# EAGLE schematic imu_v2 (EAGLE 6.4)
REV: 2.0

## Sheet 1 of 4
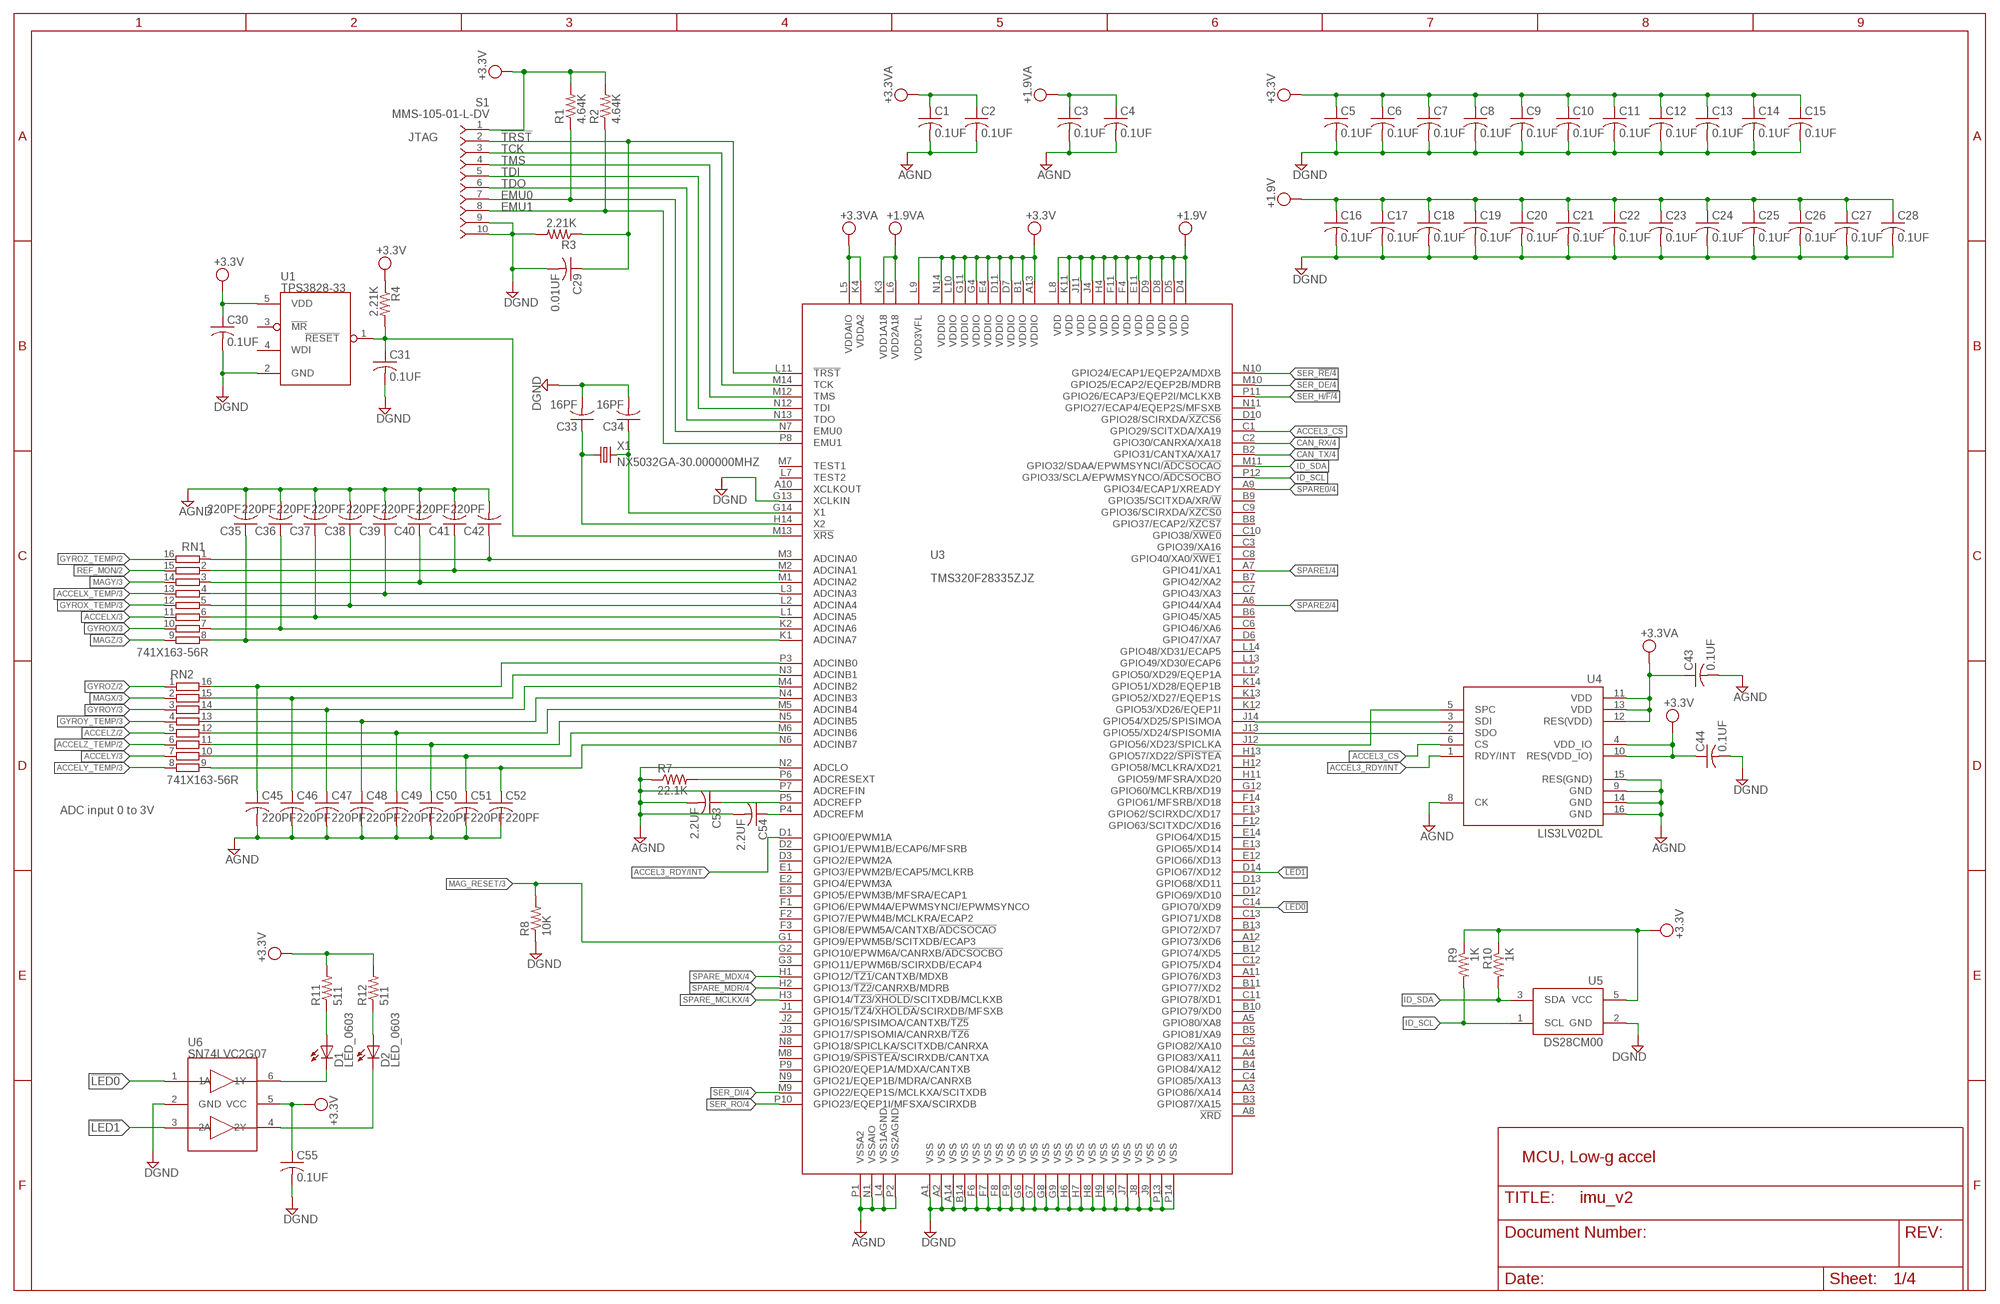
[diagram p0: schematic, sheet 1]

### Parts
C1  0.1UF  C-USC0603K  [C0603K]
C2  0.1UF  C-USC0603K  [C0603K]
C3  0.1UF  C-USC0603K  [C0603K]
C4  0.1UF  C-USC0603K  [C0603K]
C5  0.1UF  C-USC0603K  [C0603K]
C6  0.1UF  C-USC0603K  [C0603K]
C7  0.1UF  C-USC0603K  [C0603K]
C8  0.1UF  C-USC0603K  [C0603K]
C9  0.1UF  C-USC0603K  [C0603K]
C10  0.1UF  C-USC0603K  [C0603K]
C11  0.1UF  C-USC0603K  [C0603K]
C12  0.1UF  C-USC0603K  [C0603K]
C13  0.1UF  C-USC0603K  [C0603K]
C14  0.1UF  C-USC0603K  [C0603K]
C15  0.1UF  C-USC0603K  [C0603K]
C16  0.1UF  C-USC0603K  [C0603K]
C17  0.1UF  C-USC0603K  [C0603K]
C18  0.1UF  C-USC0603K  [C0603K]
C19  0.1UF  C-USC0603K  [C0603K]
C20  0.1UF  C-USC0603K  [C0603K]
C21  0.1UF  C-USC0603K  [C0603K]
C22  0.1UF  C-USC0603K  [C0603K]
C23  0.1UF  C-USC0603K  [C0603K]
C24  0.1UF  C-USC0603K  [C0603K]
C25  0.1UF  C-USC0603K  [C0603K]
C26  0.1UF  C-USC0603K  [C0603K]
C27  0.1UF  C-USC0603K  [C0603K]
C28  0.1UF  C-USC0603K  [C0603K]
C29  0.01UF  C-USC0603K  [C0603K]
C30  0.1UF  C-USC0603K  [C0603K]
C31  0.1UF  C-USC0603K  [C0603K]
C33  16PF  C-USC0603K  [C0603K]
C34  16PF  C-USC0603K  [C0603K]
C35  220PF  C-USC0603K  [C0603K]
C36  220PF  C-USC0603K  [C0603K]
C37  220PF  C-USC0603K  [C0603K]
C38  220PF  C-USC0603K  [C0603K]
C39  220PF  C-USC0603K  [C0603K]
C40  220PF  C-USC0603K  [C0603K]
C41  220PF  C-USC0603K  [C0603K]
C42  220PF  C-USC0603K  [C0603K]
C43  0.1UF  C-USC0603K  [C0603K]
C44  0.1UF  C-USC0603K  [C0603K]
C45  220PF  C-USC0603K  [C0603K]
C46  220PF  C-USC0603K  [C0603K]
C47  220PF  C-USC0603K  [C0603K]
C48  220PF  C-USC0603K  [C0603K]
C49  220PF  C-USC0603K  [C0603K]
C50  220PF  C-USC0603K  [C0603K]
C51  220PF  C-USC0603K  [C0603K]
C52  220PF  C-USC0603K  [C0603K]
C53  2.2UF  C-USC0603K  [C0603K]
C54  2.2UF  C-USC0603K  [C0603K]
C55  0.1UF  C-USC0603K  [C0603K]
D1  LED_0603  [LED_0603]
D2  LED_0603  [LED_0603]
R1  4.64K  R-US_R0603  [R0603]
R2  4.64K  R-US_R0603  [R0603]
R3  2.21K  R-US_R0603  [R0603]
R4  2.21K  R-US_R0603  [R0603]
R7  22.1K  R-US_R0603  [R0603]
R8  10K  R-US_R0603  [R0603]
R9  1K  R-US_R0603  [R0603]
R10  1K  R-US_R0603  [R0603]
R11  511  R-US_R0603  [R0603]
R12  511  R-US_R0603  [R0603]
RN1  741X163-56R  [741X163]
RN2  741X163-56R  [741X163]
S1  MMS-105-01-L-DV  [HEADER_2X5_2MM_TH]
U1  TPS3828-33  [SOT23-5]
U3  TMS320F28335ZJZ  [ZJZ_PBGA176]
U4  LIS3LV02DL  [LIS3LV02DL_LGA16]
U5  DS28CM00  [SOT23-5L]
U6  SN74LVC2G07  [SOT23-6]
X1  NX5032GA-30.000000MHZ  [NX5032GA]

### Nets
!LED0: U3.C14(GPIO70/XD9) U6.1(1A)
!LED1: U3.D14(GPIO67/XD12) U6.3(2A)
!TRST: C29.1 R3.1 S1.2 U3.L11(!TRST!)
+1.9V: C16.1 C17.1 C18.1 C19.1 C20.1 C21.1 C22.1 C23.1 C24.1 C25.1 C26.1 C27.1 C28.1 U3.D4(VDD) U3.D5(VDD) U3.D8(VDD) U3.D9(VDD) U3.E11(VDD) U3.F4(VDD) U3.F11(VDD) U3.H4(VDD) U3.J4(VDD) U3.J11(VDD) U3.K11(VDD) U3.L8(VDD) ; also sheet 4
+1.9VA: C3.1 C4.1 U3.K3(VDD1A18) U3.L6(VDD2A18) ; also sheet 4
+3.3V: C5.1 C6.1 C7.1 C8.1 C9.1 C10.1 C11.1 C12.1 C13.1 C14.1 C15.1 C30.1 C44.1 C55.1 R1.2 R2.2 R4.1 R9.1 R10.1 R11.2 R12.2 S1.1 U1.5(VDD) U3.A13(VDDIO) U3.B1(VDDIO) U3.D7(VDDIO) U3.D11(VDDIO) U3.E4(VDDIO) U3.G4(VDDIO) U3.G11(VDDIO) U3.L9(VDD3VFL) U3.L10(VDDIO) U3.N14(VDDIO) U4.4(VDD_IO) U4.10(RES(VDD_IO)) U5.5(VCC) U6.5(VCC) ; also sheet 4
+3.3VA: C1.1 C2.1 C43.1 U3.K4(VDDA2) U3.L5(VDDAIO) U4.11(VDD) U4.12(RES(VDD)) U4.13(VDD) ; also sheet 3,4
ACCEL3_CLK: U3.J12(GPIO56/XD23/SPICLKA) U4.5(SPC)
ACCEL3_CS: U3.C1(GPIO29/SCITXDA/XA19) U4.6(CS)
ACCEL3_RDY/INT: U3.D1(GPIO0/EPWM1A) U4.1(RDY/INT)
ACCEL3_SIMO: U3.J14(GPIO54/XD25/SPISIMOA) U4.3(SDI)
ACCEL3_SOMI: U3.J13(GPIO55/XD24/SPISOMIA) U4.2(SDO)
ACCELX: RN1.11 ; also sheet 3
ACCELX_TEMP: RN1.13 ; also sheet 3
ACCELY: RN2.7 ; also sheet 3
ACCELY_TEMP: RN2.8 ; also sheet 3
ACCELZ: RN2.5 ; also sheet 2
ACCELZ_TEMP: RN2.6 ; also sheet 2
AGND: C1.2 C2.2 C3.2 C4.2 C35.2 C36.2 C37.2 C38.2 C39.2 C40.2 C41.2 C42.2 C43.2 C45.2 C46.2 C47.2 C48.2 C49.2 C50.2 C51.2 C52.2 C53.2 C54.2 R7.1 U3.L4(VSS1AGND) U3.N1(VSSAIO) U3.N2(ADCLO) U3.P1(VSSA2) U3.P2(VSS2AGND) U3.P7(ADCREFIN) U4.8(CK) U4.9(GND) U4.14(GND) U4.15(RES(GND)) U4.16(GND) ; also sheet 2,3,4
CAN_RX: U3.C2(GPIO30/CANRXA/XA18) ; also sheet 4
CAN_TX: U3.B2(GPIO31/CANTXA/XA17) ; also sheet 4
DGND: C5.2 C6.2 C7.2 C8.2 C9.2 C10.2 C11.2 C12.2 C13.2 C14.2 C15.2 C16.2 C17.2 C18.2 C19.2 C20.2 C21.2 C22.2 C23.2 C24.2 C25.2 C26.2 C27.2 C28.2 C29.2 C30.2 C31.2 C33.2 C34.2 C44.2 C55.2 R3.2 R8.1 S1.9 S1.10 U1.2(GND) U3.A1(VSS) U3.A2(VSS) U3.A14(VSS) U3.B14(VSS) U3.F6(VSS) U3.F7(VSS) U3.F8(VSS) U3.F9(VSS) U3.G6(VSS) U3.G7(VSS) U3.G8(VSS) U3.G9(VSS) U3.G13(XCLKIN) U3.H6(VSS) U3.H7(VSS) U3.H8(VSS) U3.H9(VSS) U3.J6(VSS) U3.J7(VSS) U3.J8(VSS) U3.J9(VSS) U3.P13(VSS) U3.P14(VSS) U5.2(GND) U6.2(GND) ; also sheet 4
EMU0: R1.1 S1.7 U3.N7(EMU0)
EMU1: R2.1 S1.8 U3.P8(EMU1)
GYROX: RN1.10 ; also sheet 3
GYROX_TEMP: RN1.12 ; also sheet 3
GYROY: RN2.3 ; also sheet 3
GYROY_TEMP: RN2.4 ; also sheet 3
GYROZ: RN2.1 ; also sheet 2
GYROZ_TEMP: RN1.16 ; also sheet 2
ID_SCL: R9.2 U3.P12(GPIO33/SCLA/EPWMSYNCO/!ADCSOCBO!) U5.1(SCL)
ID_SDA: R10.2 U3.M11(GPIO32/SDAA/EPWMSYNCI/!ADCSOCAO!) U5.3(SDA)
MAG_RESET: R8.2 U3.G1(GPIO9/EPWM5B/SCITXDB/ECAP3) ; also sheet 3
MAGX: RN2.2 ; also sheet 3
MAGY: RN1.14 ; also sheet 3
MAGZ: RN1.9 ; also sheet 3
N$14: C42.1 RN1.1 U3.M3(ADCINA0)
N$15: C41.1 RN1.2 U3.M2(ADCINA1)
N$16: C40.1 RN1.3 U3.M1(ADCINA2)
N$17: C39.1 RN1.4 U3.L3(ADCINA3)
N$18: C38.1 RN1.5 U3.L2(ADCINA4)
N$19: C37.1 RN1.6 U3.L1(ADCINA5)
N$20: C36.1 RN1.7 U3.K2(ADCINA6)
N$21: C35.1 RN1.8 U3.K1(ADCINA7)
N$22: C45.1 RN2.16 U3.P3(ADCINB0)
N$23: C46.1 RN2.15 U3.N3(ADCINB1)
N$24: C47.1 RN2.14 U3.M4(ADCINB2)
N$25: C48.1 RN2.13 U3.N4(ADCINB3)
N$26: C49.1 RN2.12 U3.M5(ADCINB4)
N$27: C50.1 RN2.11 U3.N5(ADCINB5)
N$28: C51.1 RN2.10 U3.M6(ADCINB6)
N$29: C52.1 RN2.9 U3.N6(ADCINB7)
N$34: C31.1 R4.2 U1.1(!RESET) U3.M13(!XRS!)
N$35: C33.1 U3.H14(X2) X1.1
N$37: C34.1 U3.G14(X1) X1.2
N$45: R7.2 U3.P6(ADCRESEXT)
N$46: C54.1 U3.P4(ADCREFM)
N$47: C53.1 U3.P5(ADCREFP)
N$112: D1.A R11.1
N$116: D2.A R12.1
N$118: D1.C U6.6(1Y)
N$119: D2.C U6.4(2Y)
REF_MON: RN1.15 ; also sheet 2
SER_!RE: U3.N10(GPIO24/ECAP1/EQEP2A/MDXB) ; also sheet 4
SER_DE: U3.M10(GPIO25/ECAP2/EQEP2B/MDRB) ; also sheet 4
SER_DI: U3.M9(GPIO22/EQEP1S/MCLKXA/SCITXDB) ; also sheet 4
SER_H/!F: U3.P11(GPIO26/ECAP3/EQEP2I/MCLKXB) ; also sheet 4
SER_RO: U3.P10(GPIO23/EQEP1I/MFSXA/SCIRXDB) ; also sheet 4
SPARE0: U3.A9(GPIO34/ECAP1/XREADY) ; also sheet 4
SPARE1: U3.A7(GPIO41/XA1) ; also sheet 4
SPARE2: U3.A6(GPIO44/XA4) ; also sheet 4
SPARE_MCLKX: U3.H3(GPIO14/!TZ3!/!XHOLD!/SCITXDB/MCLKXB) ; also sheet 4
SPARE_MDR: U3.H2(GPIO13/!TZ2!/CANRXB/MDRB) ; also sheet 4
SPARE_MDX: U3.H1(GPIO12/!TZ1!/CANTXB/MDXB) ; also sheet 4
TCK: S1.3 U3.M14(TCK)
TDI: S1.5 U3.N12(TDI)
TDO: S1.6 U3.N13(TDO)
TMS: S1.4 U3.M12(TMS)
Unconnected: U1.3(!MR) U1.4(WDI) U3.A3(GPIO86/XA14) U3.A4(GPIO83/XA11) U3.A5(GPIO80/XA8) U3.A8(!XRD!) U3.A10(XCLKOUT) U3.A11(GPIO76/XD3) U3.A12(GPIO73/XD6) U3.B3(GPIO87/XA15) U3.B4(GPIO84/XA12) U3.B5(GPIO81/XA9) U3.B6(GPIO45/XA5) U3.B7(GPIO42/XA2) U3.B8(GPIO37/ECAP2/!XZCS7!) U3.B9(GPIO35/SCITXDA/XR/!W!) U3.B10(GPIO79/XD0) U3.B11(GPIO77/XD2) U3.B12(GPIO74/XD5) U3.B13(GPIO72/XD7) U3.C3(GPIO39/XA16) U3.C4(GPIO85/XA13) U3.C5(GPIO82/XA10) U3.C6(GPIO46/XA6) U3.C7(GPIO43/XA3) U3.C8(GPIO40/XA0/!XWE1!) U3.C9(GPIO36/SCIRXDA/!XZCS0!) U3.C10(GPIO38/!XWE0!) U3.C11(GPIO78/XD1) U3.C12(GPIO75/XD4) U3.C13(GPIO71/XD8) U3.D2(GPIO1/EPWM1B/ECAP6/MFSRB) U3.D3(GPIO2/EPWM2A) U3.D6(GPIO47/XA7) U3.D10(GPIO28/SCIRXDA/!XZCS6!) U3.D12(GPIO69/XD10) U3.D13(GPIO68/XD11) U3.E1(GPIO3/EPWM2B/ECAP5/MCLKRB) U3.E2(GPIO4/EPWM3A) U3.E3(GPIO5/EPWM3B/MFSRA/ECAP1) U3.E12(GPIO66/XD13) U3.E13(GPIO65/XD14) U3.E14(GPIO64/XD15) U3.F1(GPIO6/EPWM4A/EPWMSYNCI/EPWMSYNCO) U3.F2(GPIO7/EPWM4B/MCLKRA/ECAP2) U3.F3(GPIO8/EPWM5A/CANTXB/!ADCSOCAO!) U3.F12(GPIO63/SCITXDC/XD16) U3.F13(GPIO62/SCIRXDC/XD17) U3.F14(GPIO61/MFSRB/XD18) U3.G2(GPIO10/EPWM6A/CANRXB/!ADCSOCBO!) U3.G3(GPIO11/EPWM6B/SCIRXDB/ECAP4) U3.G12(GPIO60/MCLKRB/XD19) U3.H11(GPIO59/MFSRA/XD20) U3.H12(GPIO58/MCLKRA/XD21) U3.H13(GPIO57/XD22/!SPISTEA!) U3.J1(GPIO15/!TZ4!/!XHOLDA!/SCIRXDB/MFSXB) U3.J2(GPIO16/SPISIMOA/CANTXB/!TZ5!) U3.J3(GPIO17/SPISOMIA/CANRXB/!TZ6!) U3.K12(GPIO53/XD26/EQEP1I) U3.K13(GPIO52/XD27/EQEP1S) U3.K14(GPIO51/XD28/EQEP1B) U3.L7(TEST2) U3.L12(GPIO50/XD29/EQEP1A) U3.L13(GPIO49/XD30/ECAP6) U3.L14(GPIO48/XD31/ECAP5) U3.M7(TEST1) U3.M8(GPIO19/!SPISTEA!/SCIRXDB/CANTXA) U3.N8(GPIO18/SPICLKA/SCITXDB/CANRXA) U3.N9(GPIO21/EQEP1B/MDRA/CANRXB) U3.N11(GPIO27/ECAP4/EQEP2S/MFSXB) U3.P9(GPIO20/EQEP1A/MDXA/CANTXB)

### Notes on the sheet
- JTAG
- ADC input 0 to 3V
- MCU, Low-g accel

## Sheet 2 of 4
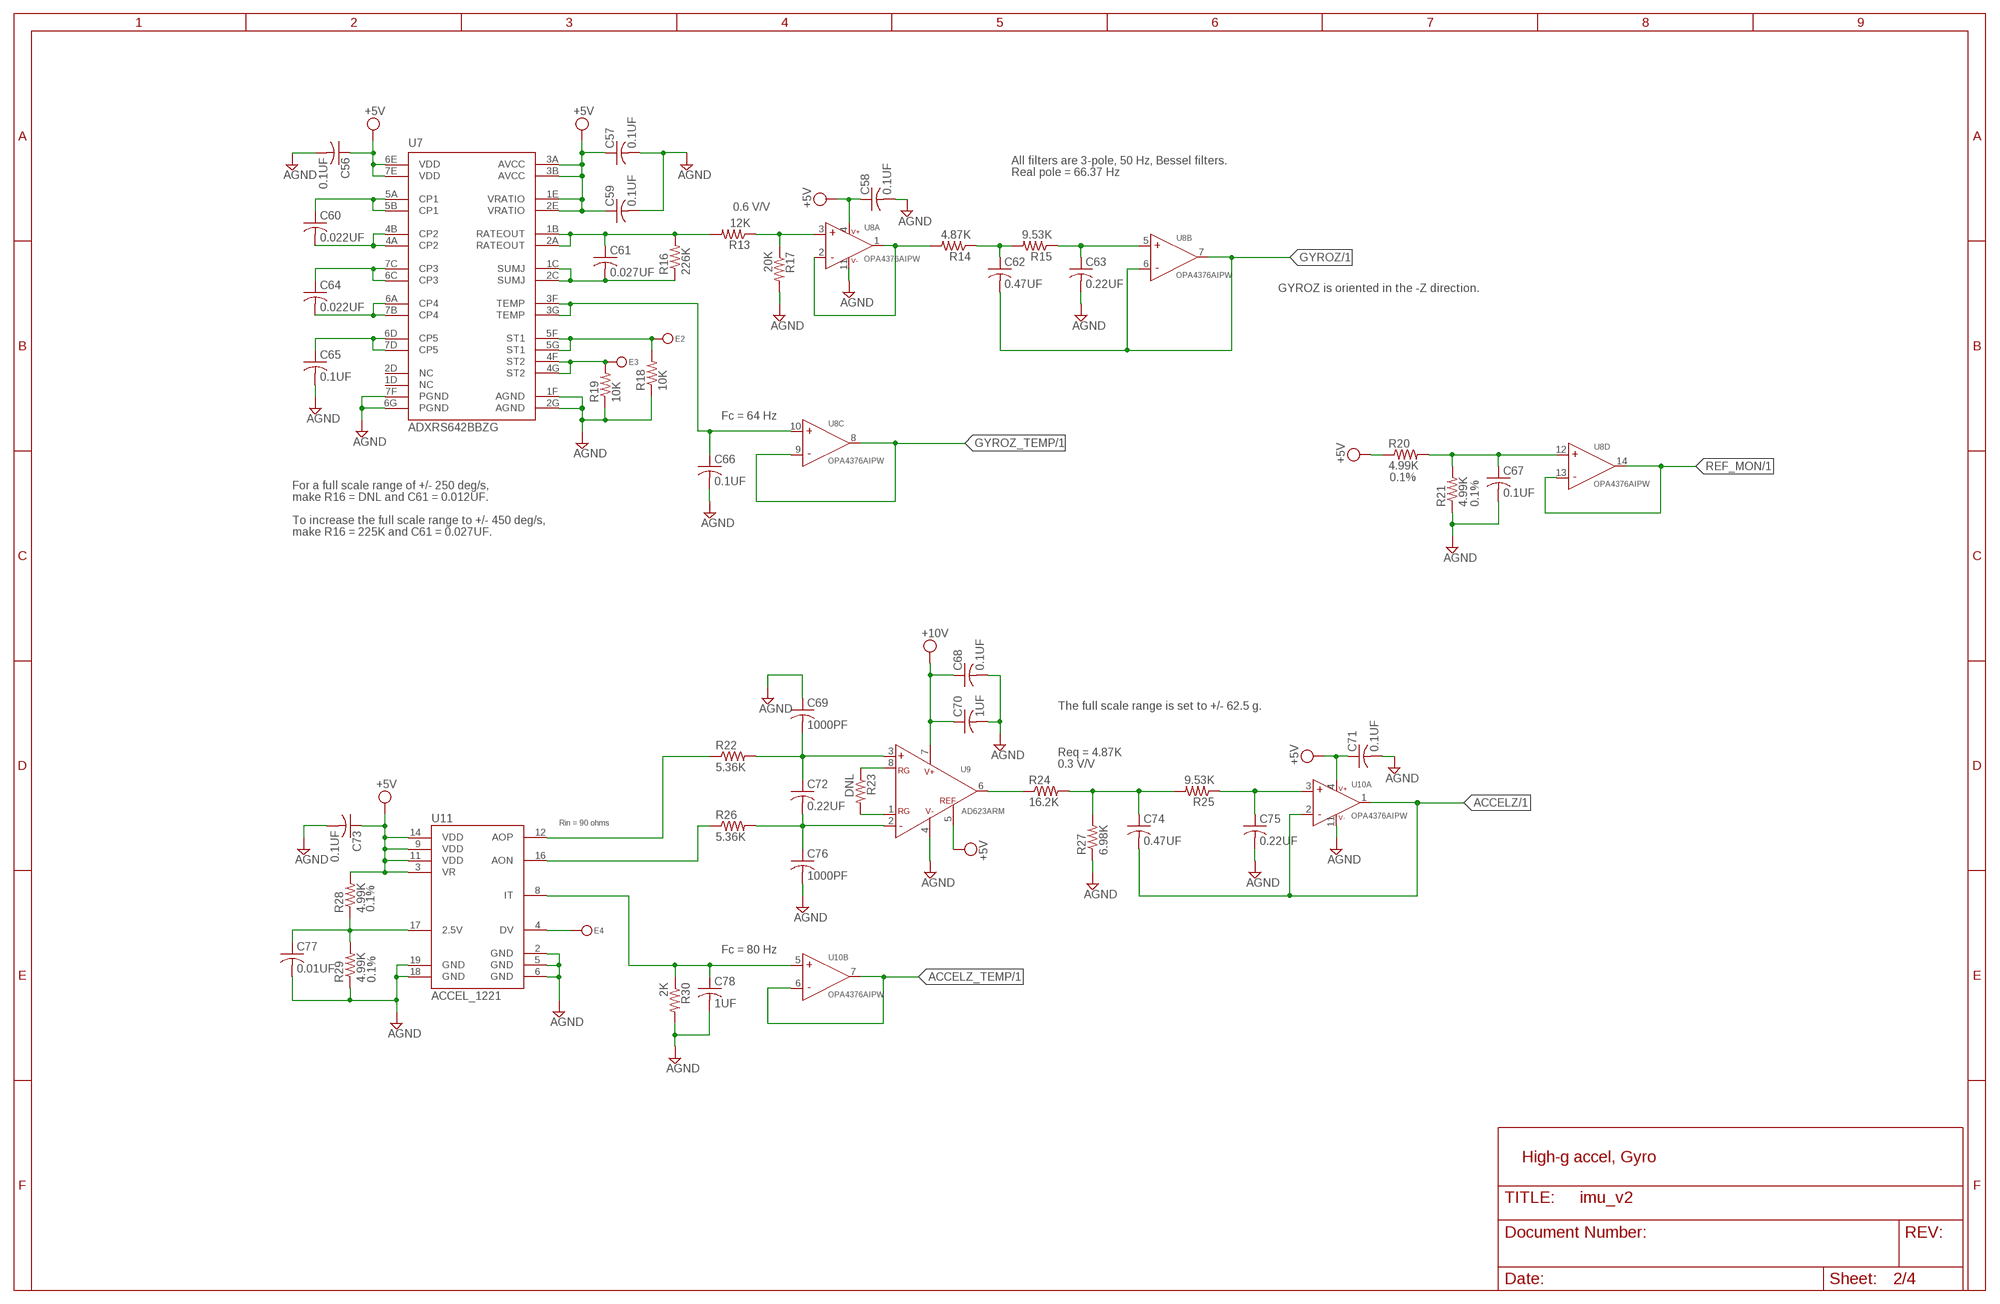
[diagram p1: schematic, sheet 2]

### Parts
C56  0.1UF  C-USC0603K  [C0603K]
C57  0.1UF  C-USC0603K  [C0603K]
C58  0.1UF  C-USC0603K  [C0603K]
C59  0.1UF  C-USC0603K  [C0603K]
C60  0.022UF  C-USC0603K  [C0603K]
C61  0.027UF  C-USC0603K  [C0603K]
C62  0.47UF  C-USC0603K  [C0603K]
C63  0.22UF  C-USC0603K  [C0603K]
C64  0.022UF  C-USC0603K  [C0603K]
C65  0.1UF  C-USC0603K  [C0603K]
C66  0.1UF  C-USC0603K  [C0603K]
C67  0.1UF  C-USC0603K  [C0603K]
C68  0.1UF  C-USC0603K  [C0603K]
C69  1000PF  C-USC0603K  [C0603K]
C70  1UF  C-USC0603K  [C0603K]
C71  0.1UF  C-USC0603K  [C0603K]
C72  0.22UF  C-USC0603K  [C0603K]
C73  0.1UF  C-USC0603K  [C0603K]
C74  0.47UF  C-USC0603K  [C0603K]
C75  0.22UF  C-USC0603K  [C0603K]
C76  1000PF  C-USC0603K  [C0603K]
C77  0.01UF  C-USC0603K  [C0603K]
C78  1UF  C-USC0603K  [C0603K]
E2  TP30  [TP30]
E3  TP30  [TP30]
E4  TP30  [TP30]
R13  12K  R-US_R0603  [R0603]
R14  4.87K  R-US_R0603  [R0603]
R15  9.53K  R-US_R0603  [R0603]
R16  226K  R-US_R0603  [R0603]
R17  20K  R-US_R0603  [R0603]
R18  10K  R-US_R0603  [R0603]
R19  10K  R-US_R0603  [R0603]
R20  4.99K  R-US_R0603  [R0603]
R21  4.99K  R-US_R0603  [R0603]
R22  5.36K  R-US_R0603  [R0603]
R23  DNL  R-US_R0603  [R0603]
R24  16.2K  R-US_R0603  [R0603]
R25  9.53K  R-US_R0603  [R0603]
R26  5.36K  R-US_R0603  [R0603]
R27  6.98K  R-US_R0603  [R0603]
R28  4.99K  R-US_R0603  [R0603]
R29  4.99K  R-US_R0603  [R0603]
R30  2K  R-US_R0603  [R0603]
U7  ADXRS642BBZG  [ADXRS_CBGA32]
U8  OPA4376AIPW  [TSSOP14]
U9  AD623ARM  [MSOP8]
U10  OPA4376AIPW  [TSSOP14]
U11  ACCEL_1221  [1221_LCC]

### Nets
+5V: C56.1 C57.1 C58.1 C59.1 C71.1 C73.1 R20.1 R28.2 U7.1E(VRATIO) U7.2E(VRATIO) U7.3A(AVCC) U7.3B(AVCC) U7.6E(VDD) U7.7E(VDD) U8.4(A:V+) U9.5(REF) U10.4(A:V+) U11.3(VR) U11.9(VDD) U11.11(VDD) U11.14(VDD) ; also sheet 3,4
+10V: C68.1 C70.1 U9.7(VS+) ; also sheet 3,4
ACCELZ: C74.2 U10.1(A:OUT) U10.2(A:IN-) ; also sheet 1
ACCELZ_TEMP: U10.6(B:IN-) U10.7(B:OUT) ; also sheet 1
AGND: C56.2 C57.2 C58.2 C59.2 C63.2 C65.2 C66.2 C67.2 C68.2 C69.1 C70.2 C71.2 C73.2 C75.2 C76.2 C77.2 C78.2 R17.2 R18.1 R19.1 R21.1 R27.1 R29.1 R30.2 U7.1F(AGND) U7.2G(AGND) U7.6G(PGND) U7.7F(PGND) U8.11(A:V-) U9.4(VS-) U10.11(A:V-) U11.2(GND) U11.5(GND) U11.6(GND) U11.18(GND) U11.19(GND) ; also sheet 1,3,4
GYROZ: C62.2 U8.6(B:IN-) U8.7(B:OUT) ; also sheet 1
GYROZ_TEMP: U8.8(C:OUT) U8.9(C:IN-) ; also sheet 1
N$1: C60.1 U7.5A(CP1) U7.5B(CP1)
N$2: C60.2 U7.4A(CP2) U7.4B(CP2)
N$3: C64.1 U7.6C(CP3) U7.7C(CP3)
N$4: C64.2 U7.6A(CP4) U7.7B(CP4)
N$5: C65.1 U7.6D(CP5) U7.7D(CP5)
N$6: C77.1 R28.1 R29.2 U11.17(2.5V)
N$7: C61.2 R16.1 U7.1C(SUMJ) U7.2C(SUMJ)
N$8: E4.1 U11.4(DV)
N$9: C61.1 R13.2 R16.2 U7.1B(RATEOUT) U7.2A(RATEOUT)
N$10: C66.1 U7.3F(TEMP) U7.3G(TEMP) U8.10(C:IN+)
N$11: C78.1 R30.1 U10.5(B:IN+) U11.8(IT)
N$12: R22.1 U11.12(AOP)
N$13: R26.1 U11.16(AON)
N$30: R13.1 R17.1 U8.3(A:IN+)
N$31: R14.2 U8.1(A:OUT) U8.2(A:IN-)
N$32: C62.1 R14.1 R15.2
N$33: C63.1 R15.1 U8.5(B:IN+)
N$36: C69.2 C72.1 R22.2 U9.3(IN+)
N$38: C72.2 C76.1 R26.2 U9.2(IN-)
N$39: C67.1 R20.2 R21.2 U8.12(D:IN+)
N$40: R23.1 U9.8(RG)
N$41: R23.2 U9.1(RG)
N$42: R24.1 U9.6(VOUT)
N$43: C74.1 R24.2 R25.2 R27.2
N$44: C75.1 R25.1 U10.3(A:IN+)
N$124: E2.1 R18.2 U7.5F(ST1) U7.5G(ST1)
N$125: E3.1 R19.2 U7.4F(ST2) U7.4G(ST2)
REF_MON: U8.13(D:IN-) U8.14(D:OUT) ; also sheet 1
Unconnected: U7.1D(NC) U7.2D(NC)

### Notes on the sheet
- All filters are 3-pole, 50 Hz, Bessel filters.
- Real pole = 66.37 Hz
- 0.6 V/V
- GYROZ is oriented in the -Z direction.
- Fc = 64 Hz
- For a full scale range of +/- 250 deg/s,
- make R16 = DNL and C61 = 0.012UF.
- To increase the full scale range to +/- 450 deg/s,
- make R16 = 225K and C61 = 0.027UF.
- The full scale range is set to +/- 62.5 g.
- Req = 4.87K
- 0.3 V/V
- Rin = 90 ohms
- Fc = 80 Hz
- High-g accel, Gyro

## Sheet 3 of 4
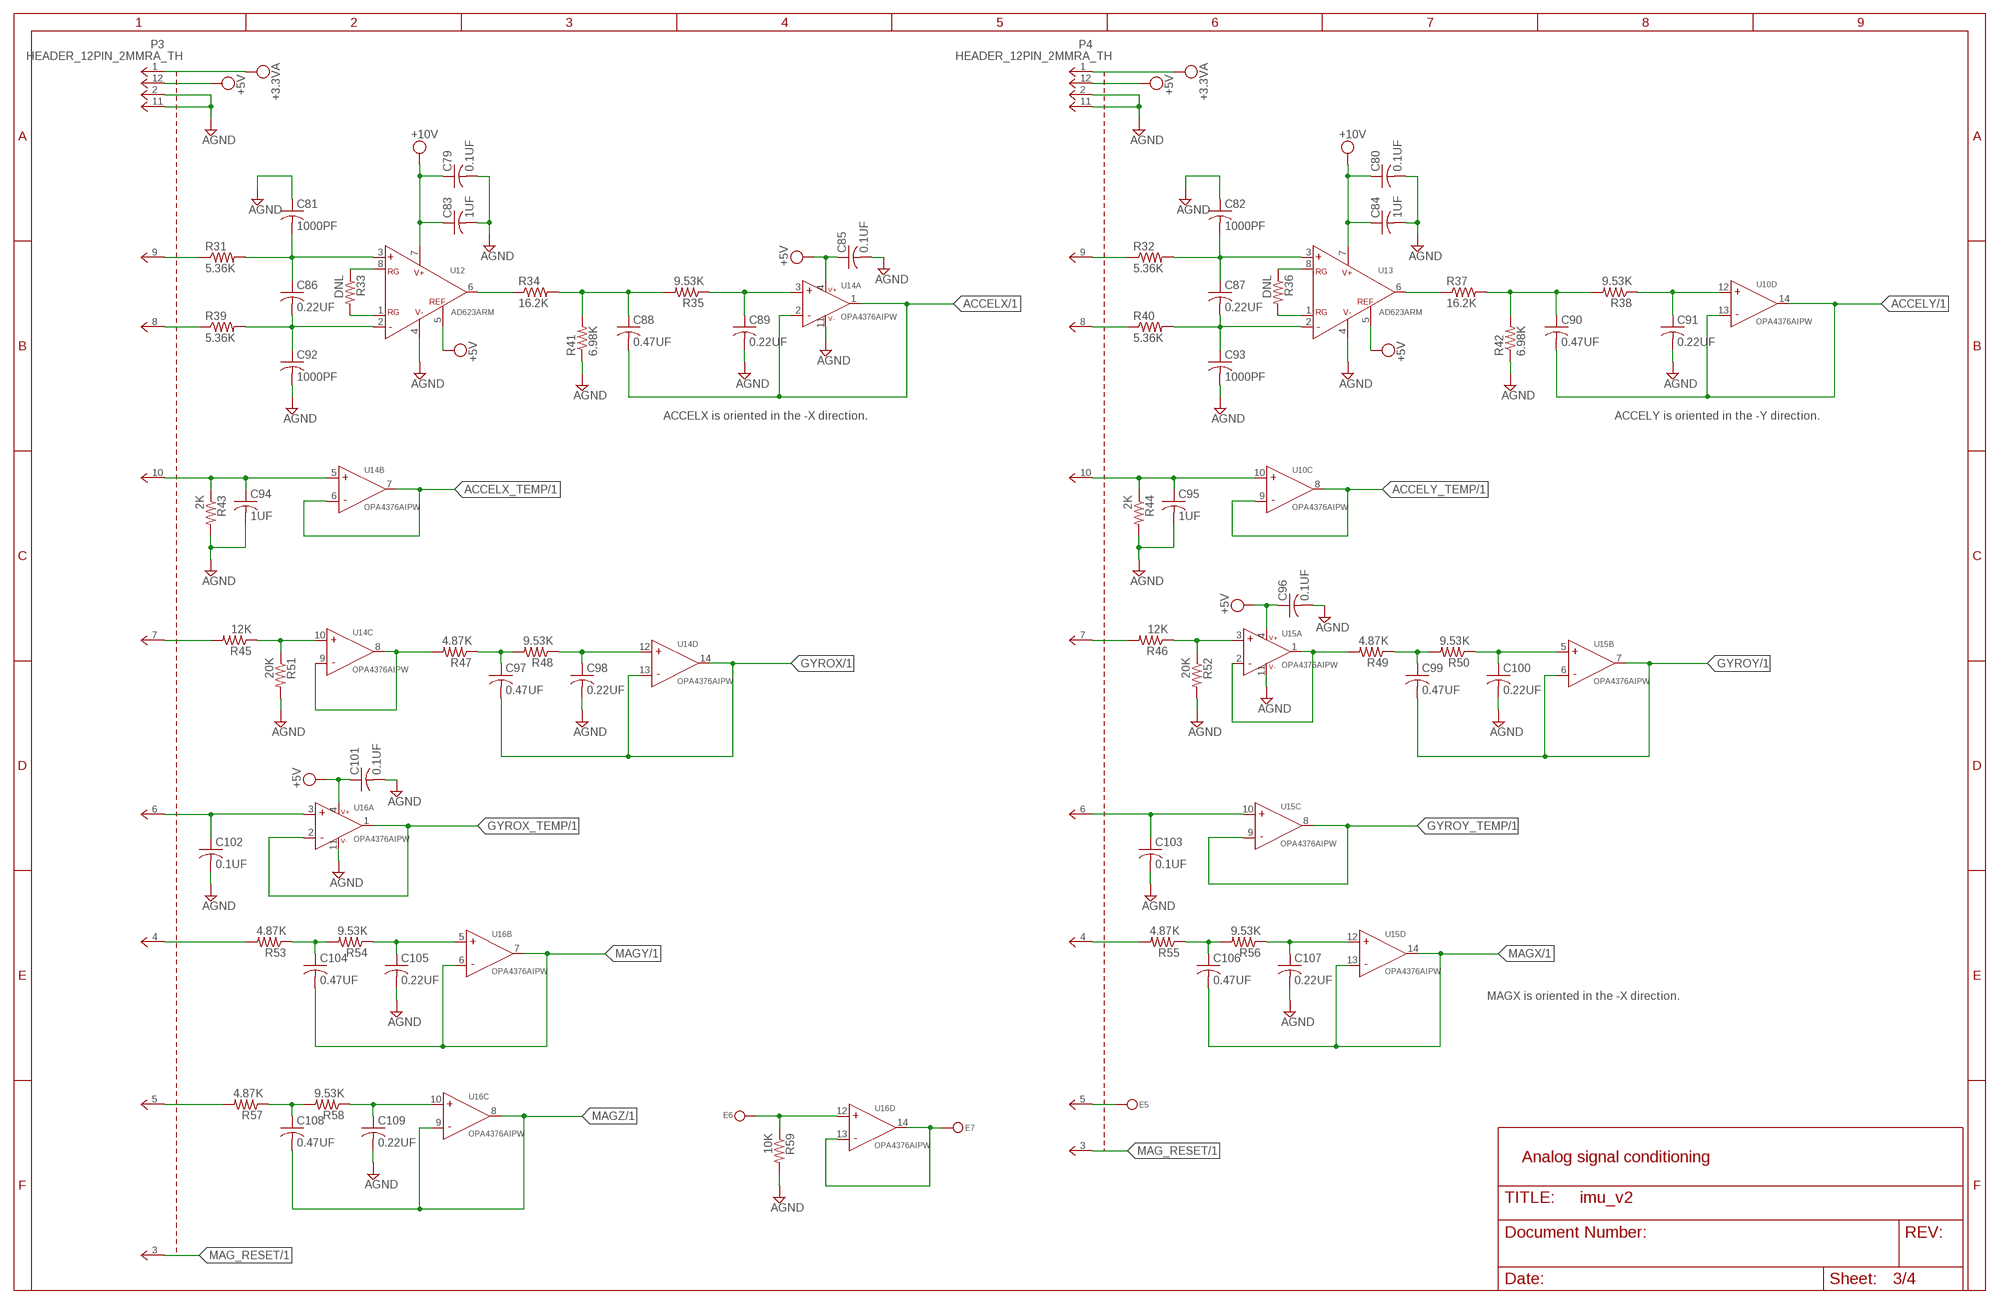
[diagram p2: schematic, sheet 3]

### Parts
C79  0.1UF  C-USC0603K  [C0603K]
C80  0.1UF  C-USC0603K  [C0603K]
C81  1000PF  C-USC0603K  [C0603K]
C82  1000PF  C-USC0603K  [C0603K]
C83  1UF  C-USC0603K  [C0603K]
C84  1UF  C-USC0603K  [C0603K]
C85  0.1UF  C-USC0603K  [C0603K]
C86  0.22UF  C-USC0603K  [C0603K]
C87  0.22UF  C-USC0603K  [C0603K]
C88  0.47UF  C-USC0603K  [C0603K]
C89  0.22UF  C-USC0603K  [C0603K]
C90  0.47UF  C-USC0603K  [C0603K]
C91  0.22UF  C-USC0603K  [C0603K]
C92  1000PF  C-USC0603K  [C0603K]
C93  1000PF  C-USC0603K  [C0603K]
C94  1UF  C-USC0603K  [C0603K]
C95  1UF  C-USC0603K  [C0603K]
C96  0.1UF  C-USC0603K  [C0603K]
C97  0.47UF  C-USC0603K  [C0603K]
C98  0.22UF  C-USC0603K  [C0603K]
C99  0.47UF  C-USC0603K  [C0603K]
C100  0.22UF  C-USC0603K  [C0603K]
C101  0.1UF  C-USC0603K  [C0603K]
C102  0.1UF  C-USC0603K  [C0603K]
C103  0.1UF  C-USC0603K  [C0603K]
C104  0.47UF  C-USC0603K  [C0603K]
C105  0.22UF  C-USC0603K  [C0603K]
C106  0.47UF  C-USC0603K  [C0603K]
C107  0.22UF  C-USC0603K  [C0603K]
C108  0.47UF  C-USC0603K  [C0603K]
C109  0.22UF  C-USC0603K  [C0603K]
E5  TP30  [TP30]
E6  TP30  [TP30]
E7  TP30  [TP30]
P3  HEADER_12PIN_2MMRA_TH  [TMM-112-01-T-S-RA]
P4  HEADER_12PIN_2MMRA_TH  [TMM-112-01-T-S-RA]
R31  5.36K  R-US_R0603  [R0603]
R32  5.36K  R-US_R0603  [R0603]
R33  DNL  R-US_R0603  [R0603]
R34  16.2K  R-US_R0603  [R0603]
R35  9.53K  R-US_R0603  [R0603]
R36  DNL  R-US_R0603  [R0603]
R37  16.2K  R-US_R0603  [R0603]
R38  9.53K  R-US_R0603  [R0603]
R39  5.36K  R-US_R0603  [R0603]
R40  5.36K  R-US_R0603  [R0603]
R41  6.98K  R-US_R0603  [R0603]
R42  6.98K  R-US_R0603  [R0603]
R43  2K  R-US_R0603  [R0603]
R44  2K  R-US_R0603  [R0603]
R45  12K  R-US_R0603  [R0603]
R46  12K  R-US_R0603  [R0603]
R47  4.87K  R-US_R0603  [R0603]
R48  9.53K  R-US_R0603  [R0603]
R49  4.87K  R-US_R0603  [R0603]
R50  9.53K  R-US_R0603  [R0603]
R51  20K  R-US_R0603  [R0603]
R52  20K  R-US_R0603  [R0603]
R53  4.87K  R-US_R0603  [R0603]
R54  9.53K  R-US_R0603  [R0603]
R55  4.87K  R-US_R0603  [R0603]
R56  9.53K  R-US_R0603  [R0603]
R57  4.87K  R-US_R0603  [R0603]
R58  9.53K  R-US_R0603  [R0603]
R59  10K  R-US_R0603  [R0603]
U12  AD623ARM  [MSOP8]
U13  AD623ARM  [MSOP8]
U14  OPA4376AIPW  [TSSOP14]
U15  OPA4376AIPW  [TSSOP14]
U16  OPA4376AIPW  [TSSOP14]

### Nets
+3.3VA: P3.1 P4.1 ; also sheet 1,4
+5V: C85.1 C96.1 C101.1 P3.12 P4.12 U12.5(REF) U13.5(REF) U14.4(A:V+) U15.4(A:V+) U16.4(A:V+) ; also sheet 2,4
+10V: C79.1 C80.1 C83.1 C84.1 U12.7(VS+) U13.7(VS+) ; also sheet 2,4
ACCELX: C88.2 U14.1(A:OUT) U14.2(A:IN-) ; also sheet 1
ACCELX_TEMP: U14.6(B:IN-) U14.7(B:OUT) ; also sheet 1
ACCELY: C90.2 U10.13(D:IN-) U10.14(D:OUT) ; also sheet 1
ACCELY_TEMP: U10.8(C:OUT) U10.9(C:IN-) ; also sheet 1
AGND: C79.2 C80.2 C81.1 C82.1 C83.2 C84.2 C85.2 C89.2 C91.2 C92.2 C93.2 C94.2 C95.2 C96.2 C98.2 C100.2 C101.2 C102.2 C103.2 C105.2 C107.2 C109.2 P3.2 P3.11 P4.2 P4.11 R41.1 R42.1 R43.2 R44.2 R51.2 R52.2 R59.2 U12.4(VS-) U13.4(VS-) U14.11(A:V-) U15.11(A:V-) U16.11(A:V-) ; also sheet 1,2,4
GYROX: C97.2 U14.13(D:IN-) U14.14(D:OUT) ; also sheet 1
GYROX_TEMP: U16.1(A:OUT) U16.2(A:IN-) ; also sheet 1
GYROY: C99.2 U15.6(B:IN-) U15.7(B:OUT) ; also sheet 1
GYROY_TEMP: U15.8(C:OUT) U15.9(C:IN-) ; also sheet 1
MAG_RESET: P3.3 P4.3 ; also sheet 1
MAGX: C106.2 U15.13(D:IN-) U15.14(D:OUT) ; also sheet 1
MAGY: C104.2 U16.6(B:IN-) U16.7(B:OUT) ; also sheet 1
MAGZ: C108.2 U16.8(C:OUT) U16.9(C:IN-) ; also sheet 1
N$48: E7.1 U16.13(D:IN-) U16.14(D:OUT)
N$49: E6.1 R59.1 U16.12(D:IN+)
N$56: E5.1 P4.5
N$68: P3.7 R45.2
N$69: R45.1 R51.1 U14.10(C:IN+)
N$70: R47.2 U14.8(C:OUT) U14.9(C:IN-)
N$72: C97.1 R47.1 R48.2
N$73: C98.1 R48.1 U14.12(D:IN+)
N$74: P4.7 R46.2
N$75: R46.1 R52.1 U15.3(A:IN+)
N$76: R49.2 U15.1(A:OUT) U15.2(A:IN-)
N$77: C99.1 R49.1 R50.2
N$78: C100.1 R50.1 U15.5(B:IN+)
N$79: C103.1 P4.6 U15.10(C:IN+)
N$80: C102.1 P3.6 U16.3(A:IN+)
N$81: C95.1 P4.10 R44.1 U10.10(C:IN+)
N$82: P3.4 R53.2
N$83: P4.9 R32.1
N$84: C82.2 C87.1 R32.2 U13.3(IN+)
N$85: C87.2 C93.1 R40.2 U13.2(IN-)
N$86: R36.1 U13.8(RG)
N$87: R36.2 U13.1(RG)
N$88: R37.1 U13.6(VOUT)
N$89: C90.1 R37.2 R38.2 R42.2
N$90: C91.1 R38.1 U10.12(D:IN+)
N$91: C94.1 P3.10 R43.1 U14.5(B:IN+)
N$92: P3.9 R31.1
N$93: P3.8 R39.1
N$94: C81.2 C86.1 R31.2 U12.3(IN+)
N$95: C86.2 C92.1 R39.2 U12.2(IN-)
N$96: R33.1 U12.8(RG)
N$97: R33.2 U12.1(RG)
N$98: R34.1 U12.6(VOUT)
N$99: C88.1 R34.2 R35.2 R41.2
N$100: C89.1 R35.1 U14.3(A:IN+)
N$101: P4.8 R40.1
N$102: C104.1 R53.1 R54.2
N$103: C105.1 R54.1 U16.5(B:IN+)
N$104: P3.5 R57.2
N$105: C108.1 R57.1 R58.2
N$106: C109.1 R58.1 U16.10(C:IN+)
N$107: P4.4 R55.2
N$108: C106.1 R55.1 R56.2
N$110: C107.1 R56.1 U15.12(D:IN+)

### Notes on the sheet
- ACCELX is oriented in the -X direction. | ACCELY is oriented in the -Y direction.
- MAGX is oriented in the -X direction.
- Analog signal conditioning

## Sheet 4 of 4
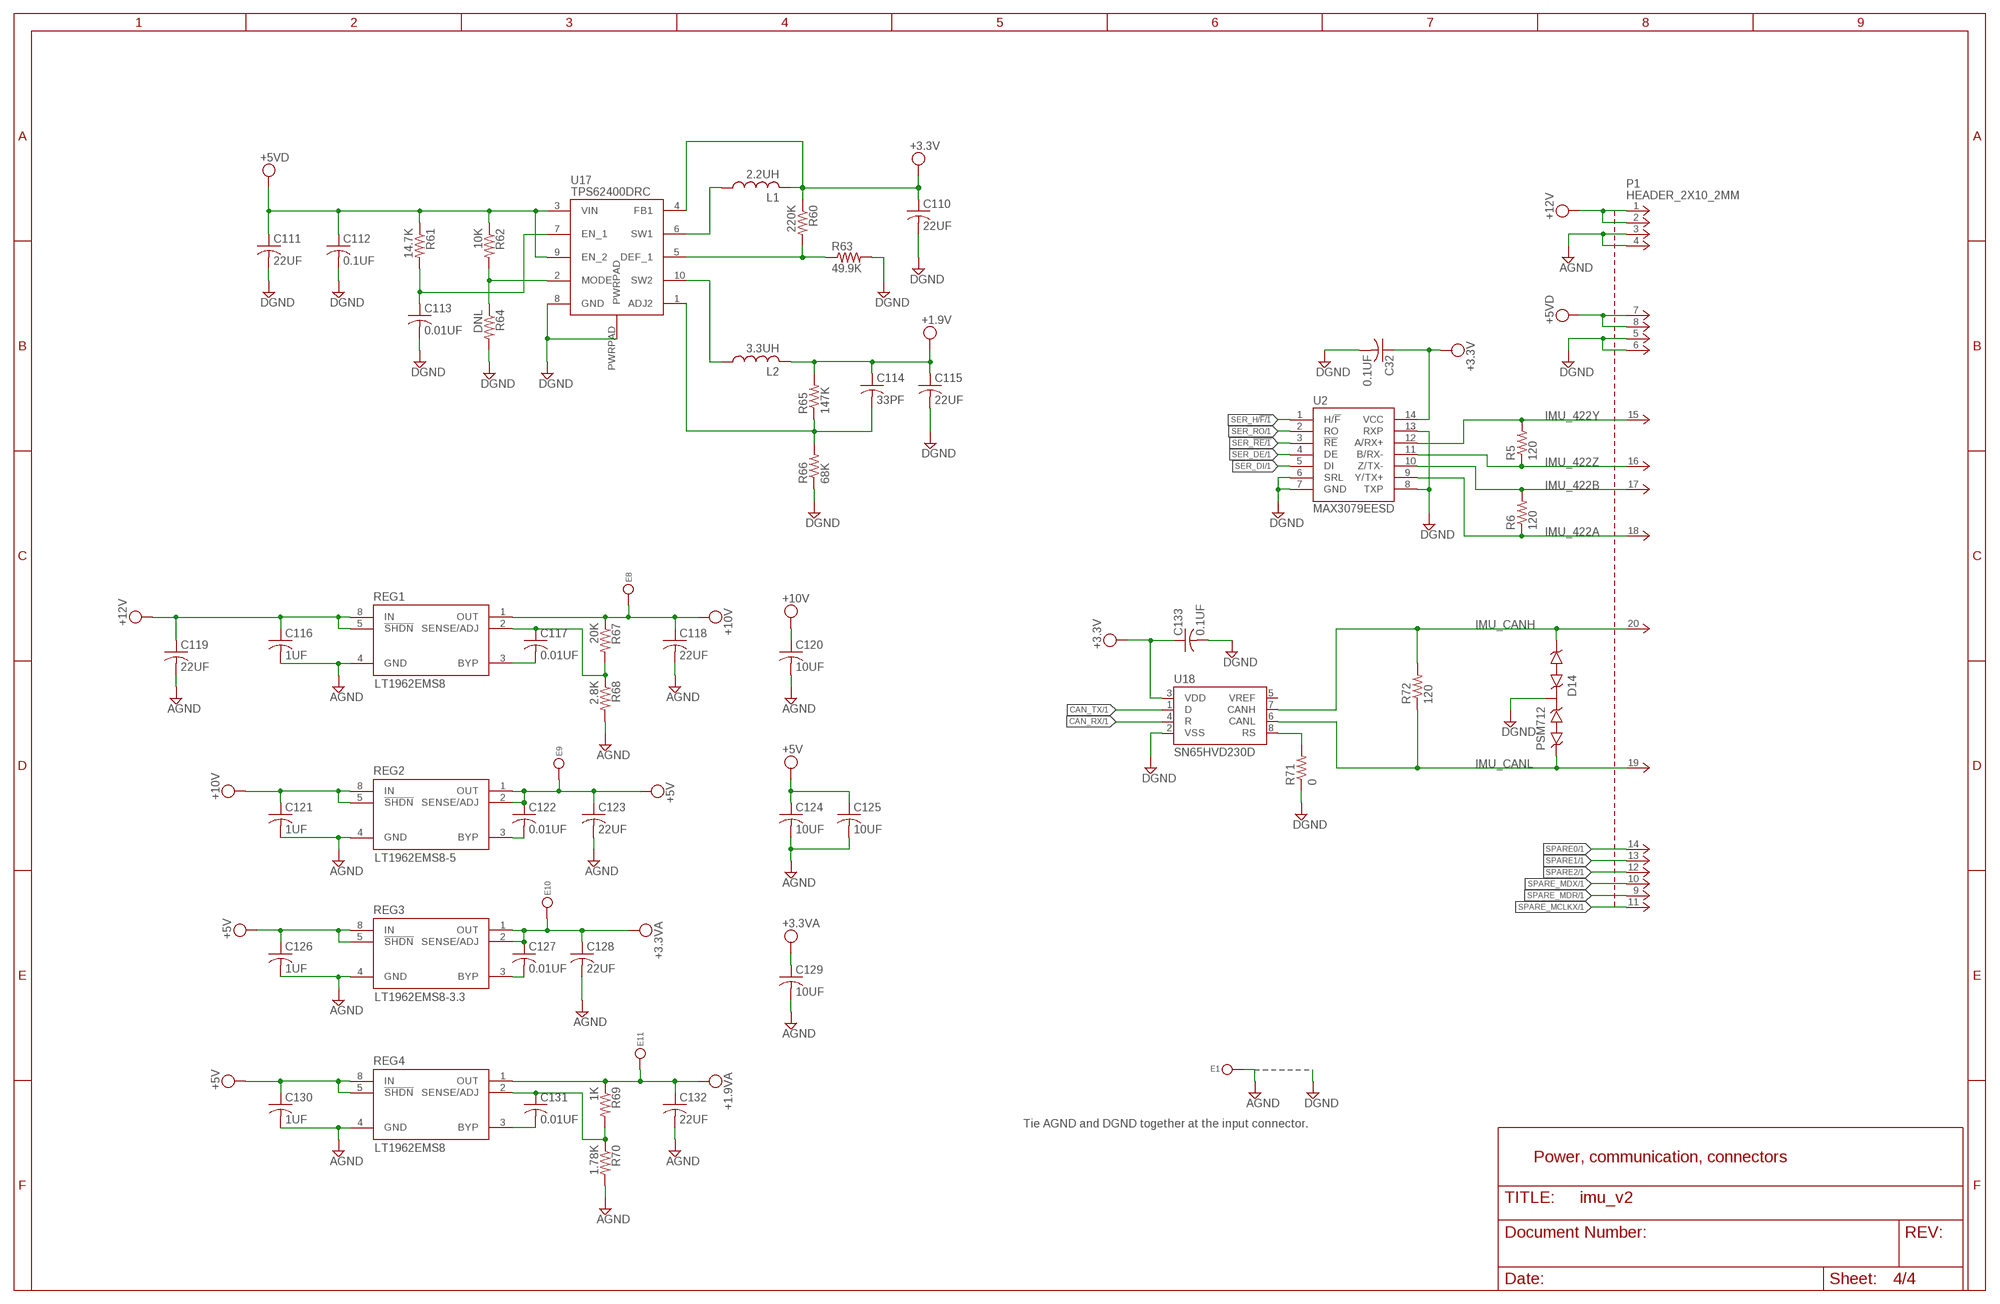
[diagram p3: schematic, sheet 4]

### Parts
C32  0.1UF  C-USC0603K  [C0603K]
C110  22UF  C-USC1210K  [C1210K]
C111  22UF  C-USC1210K  [C1210K]
C112  0.1UF  C-USC0603K  [C0603K]
C113  0.01UF  C-USC0603K  [C0603K]
C114  33PF  C-USC0603K  [C0603K]
C115  22UF  C-USC1210K  [C1210K]
C116  1UF  C-USC0603K  [C0603K]
C117  0.01UF  C-USC0603K  [C0603K]
C118  22UF  C-USC1210K  [C1210K]
C119  22UF  C-USC1210K  [C1210K]
C120  10UF  C-USC1206K  [C1206K]
C121  1UF  C-USC0603K  [C0603K]
C122  0.01UF  C-USC0603K  [C0603K]
C123  22UF  C-USC1210K  [C1210K]
C124  10UF  C-USC1206K  [C1206K]
C125  10UF  C-USC1206K  [C1206K]
C126  1UF  C-USC0603K  [C0603K]
C127  0.01UF  C-USC0603K  [C0603K]
C128  22UF  C-USC1210K  [C1210K]
C129  10UF  C-USC1206K  [C1206K]
C130  1UF  C-USC0603K  [C0603K]
C131  0.01UF  C-USC0603K  [C0603K]
C132  22UF  C-USC1210K  [C1210K]
C133  0.1UF  C-USC0603K  [C0603K]
D14  PSM712  [SOT23]
E1  5015_TESTCLIP  [5015_TESTCLIP]
E8  TP30  [TP30]
E9  TP30  [TP30]
E10  TP30  [TP30]
E11  TP30  [TP30]
L1  2.2UH  L2.2_UHVLF3010A  [VLF3010A]
L2  3.3UH  L3.3_UHVLF3010A  [VLF3010A]
P1  HEADER_2X10_2MM  [HEADER_2X10_2MM]
R5  120  R-US_R0603  [R0603]
R6  120  R-US_R0603  [R0603]
R60  220K  R-US_R0603  [R0603]
R61  14.7K  R-US_R0603  [R0603]
R62  10K  R-US_R0603  [R0603]
R63  49.9K  R-US_R0603  [R0603]
R64  DNL  R-US_R0603  [R0603]
R65  147K  R-US_R0603  [R0603]
R66  68K  R-US_R0603  [R0603]
R67  20K  R-US_R0603  [R0603]
R68  2.8K  R-US_R0603  [R0603]
R69  1K  R-US_R0603  [R0603]
R70  1.78K  R-US_R0603  [R0603]
R71  0  R-US_R0603  [R0603]
R72  120  R-US_R0603  [R0603]
REG1  LT1962EMS8  [MSOP8]
REG2  LT1962EMS8-5  [MSOP8]
REG3  LT1962EMS8-3.3  [MSOP8]
REG4  LT1962EMS8  [MSOP8]
U2  MAX3079EESD  [SOIC14-NARROW]
U17  TPS62400DRC  [QFN10]
U18  SN65HVD230D  [SO08]

### Nets
+1.9V: C114.1 C115.1 L2.2 R65.2 ; also sheet 1
+1.9VA: C132.1 E11.1 R69.1 REG4.1(OUT) ; also sheet 1
+3.3V: C32.1 C110.1 C133.1 L1.2 R60.1 U2.14(VCC) U17.4(FB1) U18.3(VDD) ; also sheet 1
+3.3VA: C127.1 C128.1 C129.1 E10.1 REG3.1(OUT) REG3.2(SENSE/ADJ) ; also sheet 1,3
+5V: C122.1 C123.1 C124.1 C125.1 C126.1 C130.1 E9.1 REG2.1(OUT) REG2.2(SENSE/ADJ) REG3.5(!SHDN) REG3.8(IN) REG4.5(!SHDN) REG4.8(IN) ; also sheet 2,3
+5VD: C111.1 C112.1 P1.7 P1.8 R61.1 R62.1 U17.3(VIN) U17.9(EN_2)
+10V: C118.1 C120.1 C121.1 E8.1 R67.1 REG1.1(OUT) REG2.5(!SHDN) REG2.8(IN) ; also sheet 2,3
+12V: C116.1 C119.1 P1.1 P1.2 REG1.5(!SHDN) REG1.8(IN)
AGND: C116.2 C118.2 C119.2 C120.2 C121.2 C123.2 C124.2 C125.2 C126.2 C128.2 C129.2 C130.2 C132.2 E1.1 P1.3 P1.4 R68.2 R70.2 REG1.4(GND) REG2.4(GND) REG3.4(GND) REG4.4(GND) ; also sheet 1,2,3
CAN_RX: U18.4(R) ; also sheet 1
CAN_TX: U18.1(D) ; also sheet 1
DGND: C32.2 C110.2 C111.2 C112.2 C113.2 C115.2 C133.2 D14.3 P1.5 P1.6 R63.2 R64.2 R66.1 R71.1 U2.6(SRL) U2.7(GND) U2.8(TXP) U2.13(RXP) U17.8(GND) U17.PWRPAD U18.2(VSS) ; also sheet 1
IMU_422A: P1.18 R6.1 U2.9(Y/TX+)
IMU_422B: P1.17 R6.2 U2.10(Z/TX-)
IMU_422Y: P1.15 R5.2 U2.12(A/RX+)
IMU_422Z: P1.16 R5.1 U2.11(B/RX-)
IMU_CANH: D14.1 P1.20 R72.2 U18.7(CANH)
IMU_CANL: D14.2 P1.19 R72.1 U18.6(CANL)
N$50: R71.2 U18.8(RS)
N$63: C122.2 REG2.3(BYP)
N$64: C127.2 REG3.3(BYP)
N$65: C117.2 REG1.3(BYP)
N$66: C117.1 R67.2 R68.1 REG1.2(SENSE/ADJ)
N$67: C131.2 REG4.3(BYP)
N$71: C131.1 R69.2 R70.1 REG4.2(SENSE/ADJ)
N$109: L1.1 U17.6(SW1)
N$111: L2.1 U17.10(SW2)
N$113: R60.2 R63.1 U17.5(DEF_1)
N$114: R62.2 R64.1 U17.2(MODE)
N$115: C114.2 R65.1 R66.2 U17.1(ADJ2)
N$117: C113.1 R61.2 U17.7(EN_1)
SER_!RE: U2.3(!RE) ; also sheet 1
SER_DE: U2.4(DE) ; also sheet 1
SER_DI: U2.5(DI) ; also sheet 1
SER_H/!F: U2.1(H/!F) ; also sheet 1
SER_RO: U2.2(RO) ; also sheet 1
SPARE0: P1.14 ; also sheet 1
SPARE1: P1.13 ; also sheet 1
SPARE2: P1.12 ; also sheet 1
SPARE_MCLKX: P1.11 ; also sheet 1
SPARE_MDR: P1.9 ; also sheet 1
SPARE_MDX: P1.10 ; also sheet 1
Unconnected: U18.5(VREF)

### Notes on the sheet
- Tie AGND and DGND together at the input connector.
- Power, communication, connectors

## Library data of the parts
C1-C133 = rcl:C-US: CAPACITOR, American symbol
D1 D2 = diodes:LED_: LEDs LED device definition; VENDOR: Digikey; VENDOR_PN: 160-1438-1-ND
D14 = diodes:PSM712: PSM712 Protek Devices - 600 W TVS Array Asymmetrical Data Line Protector SOT-23 Package; VENDOR: Future Electronics; VENDOR_PN: PSM712
E1 = connector:5015_TESTCLIP; VENDOR: Digikey; VENDOR_PN: 5015KCT-ND
E2-E11 = connector:TP30
L1 = passives:L: Inductors and ferrites; VENDOR: Digikey; VENDOR_PN: 445-3215-1-ND
L2 = passives:L: Inductors and ferrites; VENDOR: Digikey; VENDOR_PN: 445-3216-1-ND
P1 = connector:HEADER_2X10: 2 x 10 Pin Header
P3 P4 = connector:HEADER_12PIN_2MM; VENDOR: Samtec; VENDOR_PN: TMM-112-01-T-S-RA
R1-R19 R22-R27 R30-R72 = rcl:R-US_: RESISTOR, American symbol
R20 R21 R28 R29 = rcl:R-US_: RESISTOR, American symbol; TOL: 0.1%; VENDOR: Digikey; VENDOR_PN: TNP4.99KAACT-ND
REG1 REG4 = power_conversion:LT1*62: Linear Technologies 150 mA and 300 mA LDO regulators.; CURRENT: 300 mA; VENDOR: Digikey; VENDOR_PN: LT1962EMS8#PBF-ND
REG2 = power_conversion:LT1*62: Linear Technologies 150 mA and 300 mA LDO regulators.; CURRENT: 300mA; VENDOR: Digikey; VENDOR_PN: LT1962EMS8-5#PBF-ND
REG3 = power_conversion:LT1*62: Linear Technologies 150 mA and 300 mA LDO regulators.; CURRENT: 300mA; VENDOR: Digikey; VENDOR_PN: LT1962EMS8-3.3#PBF-ND
RN1 RN2 = passives:741X163: Eight resistor array (0402); VENDOR: Digikey; VENDOR_PN: 741X163560JPCT-ND
S1 = connector:MMS-105-01-L-DV; VENDOR: Samtec; VENDOR_PN: MMS-105-01-L-DV
U1 = ic:TPS3828: TPS3828-xx Processor Supervisory Circuits SOT23-5 Package; VENDOR: Digikey; VENDOR_PN: 296-2638-1-ND
U2 = ic:MAX3079E: Selectable RS422/RS485 16Mbsp transceiver (+3.3V).; VENDOR: Digikey; VENDOR_PN: MAX3079EESD+-ND
U3 = ic:TMS320F28335: TI Floating Point DSP; VENDOR: Mouser; VENDOR_PN: 595-TMS320F28335ZJZA
U4 = sensor:LIS3LV02DL: STM 3-axis 2g to 6g digital accelerometer.; VENDOR: Digikey; VENDOR_PN: 497-8415-1-ND
U5 = ic:DS28CM00; VENDOR: Maxim IC; VENDOR_PN: DS28CM00R-A00+T
U6 = ic:SN74*2G07: Dual open-drain driver.; VENDOR: Digikey; VENDOR_PN: 296-13494-1-ND
U7 = sensor:ADXRS*: Analog Devices MEMS GRYO; VENDOR: Digikey; VENDOR_PN: ADXRS642BBGZ-ND
U8 U10 U14-U16 = amplifiers:OPA4376: Quad R-R precision op-amp.; VENDOR: Digikey; VENDOR_PN: 296-22565-1-ND
U9 U12 U13 = amplifiers:AD623: R-R instrumentation amplifier.; VENDOR: Digikey; VENDOR_PN: AD623ARMZ-ND
U11 = sensor:ACCEL_1221: Precision MEMS accelerometer.; VENDOR: Silicon Designs; VENDOR_PN: 1221L-050
U17 = power_conversion:TPS624*: Dual step-down DC-DC converter.; IOUT: 400mA/600mA; VENDOR: Digikey; VENDOR_PN: 296-20690-1-ND
U18 = ic:SN65HVD230: TI 3.3V CAN tranceiver with slope control.; VENDOR: Digikey; VENDOR_PN: 296-11654-1-ND
X1 = oscillators:NX5032GA: Crystal 8.0pF SMD; VENDOR: Digikey; VENDOR_PN: 644-1043-1-ND